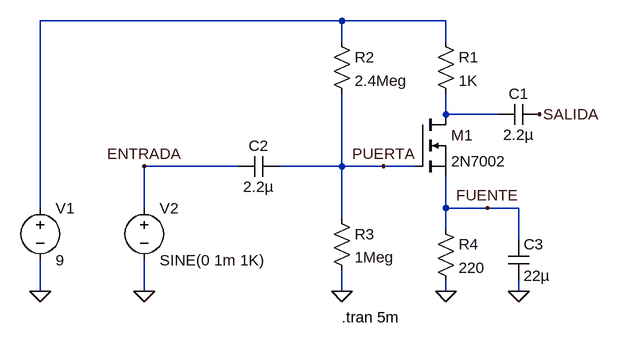
[diagram p0: schematic mosfet-amplificador2.asc]
mosfet-amplificador2.asc, the LTspice schematic file:
Version 4
SHEET 1 880 680
WIRE 208 -48 -256 -48
WIRE 368 -48 208 -48
WIRE 208 -16 208 -48
WIRE 368 -16 368 -48
WIRE 368 96 368 64
WIRE 448 96 368 96
WIRE 48 176 -96 176
WIRE 208 176 208 64
WIRE 208 176 112 176
WIRE 272 176 208 176
WIRE 320 176 272 176
WIRE -256 240 -256 -48
WIRE -96 240 -96 176
WIRE 368 240 368 192
WIRE 432 240 368 240
WIRE 480 240 432 240
WIRE 208 256 208 176
WIRE 368 272 368 240
WIRE 480 288 480 240
WIRE -256 368 -256 320
WIRE -96 368 -96 320
WIRE 208 368 208 336
WIRE 368 368 368 352
WIRE 480 368 480 352
FLAG -96 368 0
FLAG 368 368 0
FLAG -256 368 0
FLAG 512 96 SALIDA
FLAG -96 176 ENTRADA
FLAG 208 368 0
FLAG 480 368 0
FLAG 272 176 PUERTA
FLAG 432 240 FUENTE
SYMBOL res 352 -32 R0
SYMATTR InstName R1
SYMATTR Value 1K
SYMBOL voltage -256 224 R0
WINDOW 123 0 0 Left 0
WINDOW 39 0 0 Left 0
SYMATTR InstName V1
SYMATTR Value 9
SYMBOL voltage -96 224 R0
WINDOW 123 0 0 Left 0
WINDOW 39 0 0 Left 0
SYMATTR InstName V2
SYMATTR Value SINE(0 1m 1K)
SYMBOL cap 512 80 R90
WINDOW 0 0 32 VBottom 2
WINDOW 3 32 32 VTop 2
SYMATTR InstName C1
SYMATTR Value 2.2µ
SYMBOL cap 112 160 R90
WINDOW 0 0 32 VBottom 2
WINDOW 3 32 32 VTop 2
SYMATTR InstName C2
SYMATTR Value 2.2µ
SYMBOL res 192 -32 R0
SYMATTR InstName R2
SYMATTR Value 2.4Meg
SYMBOL res 192 240 R0
SYMATTR InstName R3
SYMATTR Value 1Meg
SYMBOL res 352 256 R0
SYMATTR InstName R4
SYMATTR Value 220
SYMBOL cap 464 288 R0
SYMATTR InstName C3
SYMATTR Value 22µ
SYMBOL nmos 320 96 R0
SYMATTR InstName M1
SYMATTR Value 2N7002
TEXT 208 408 Left 2 !.tran 5m

The netlist it stands for:
* mosfet-amplificador2.asc
R1 N001 N002 1K
V1 N001 0 9
V2 ENTRADA 0 SINE(0 1m 1K)
C1 SALIDA N002 2.2µ
C2 PUERTA ENTRADA 2.2µ
R2 N001 PUERTA 2.4Meg
R3 PUERTA 0 1Meg
R4 FUENTE 0 220
C3 FUENTE 0 22µ
M1 N002 PUERTA FUENTE FUENTE 2N7002
.model NMOS NMOS
.model PMOS PMOS
.lib standard.mos
.tran 5m
.backanno
.end